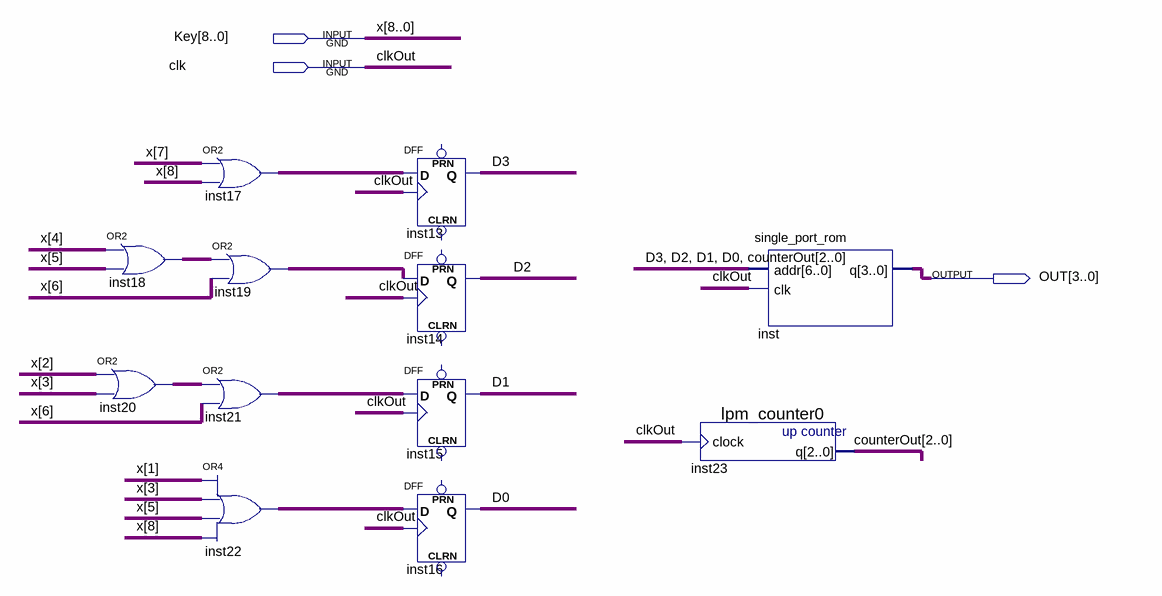
[diagram p0: schematic sheet]
// Quartus schematic sapr2.bdf as structural Verilog: 12 symbols, 3 pins
module sapr2 (
  input  [8:0] Key,
  input  clk,
  output [3:0] OUT
);

  wire D0, D1, D2, D3, inst17_out, inst18_out, inst19_out, inst20_out, inst21_out, inst22_out;
  wire [2:0] counterOut;

  or inst18 (inst18_out, Key[4], Key[5]);
  or inst20 (inst20_out, Key[2], Key[3]);
  or inst17 (inst17_out, Key[7], Key[8]);
  or inst21 (inst21_out, inst20_out, Key[6]);
  or inst22 (inst22_out, Key[1], Key[3], Key[5], Key[8]);
  or inst19 (inst19_out, inst18_out, Key[6]);
  DFF inst13 (.CLK(clk), .D(inst17_out), .Q(D3));  // open: CLRN, PRN
  DFF inst14 (.CLK(clk), .D(inst19_out), .Q(D2));  // open: CLRN, PRN
  DFF inst15 (.CLK(clk), .D(inst21_out), .Q(D1));  // open: CLRN, PRN
  DFF inst16 (.CLK(clk), .D(inst22_out), .Q(D0));  // open: CLRN, PRN
  lpm_counter0 inst23 (.clock(clk), .q(counterOut));
  single_port_rom inst (.addr({D3, D2, D1, D0, counterOut}), .clk(clk), .q(OUT));

  // Other names for the same wires on the sheet: clkOut = clk; x[8:0] = Key
endmodule
